# Altium schematic sheet Sheet1_Analog.SchDoc
size A4; Author: 卡文迪许怪; CompanyName: 创客工坊; DrawnBy: 创客工坊; Revision: Final; SheetNumber: 1; SheetTotal: 2
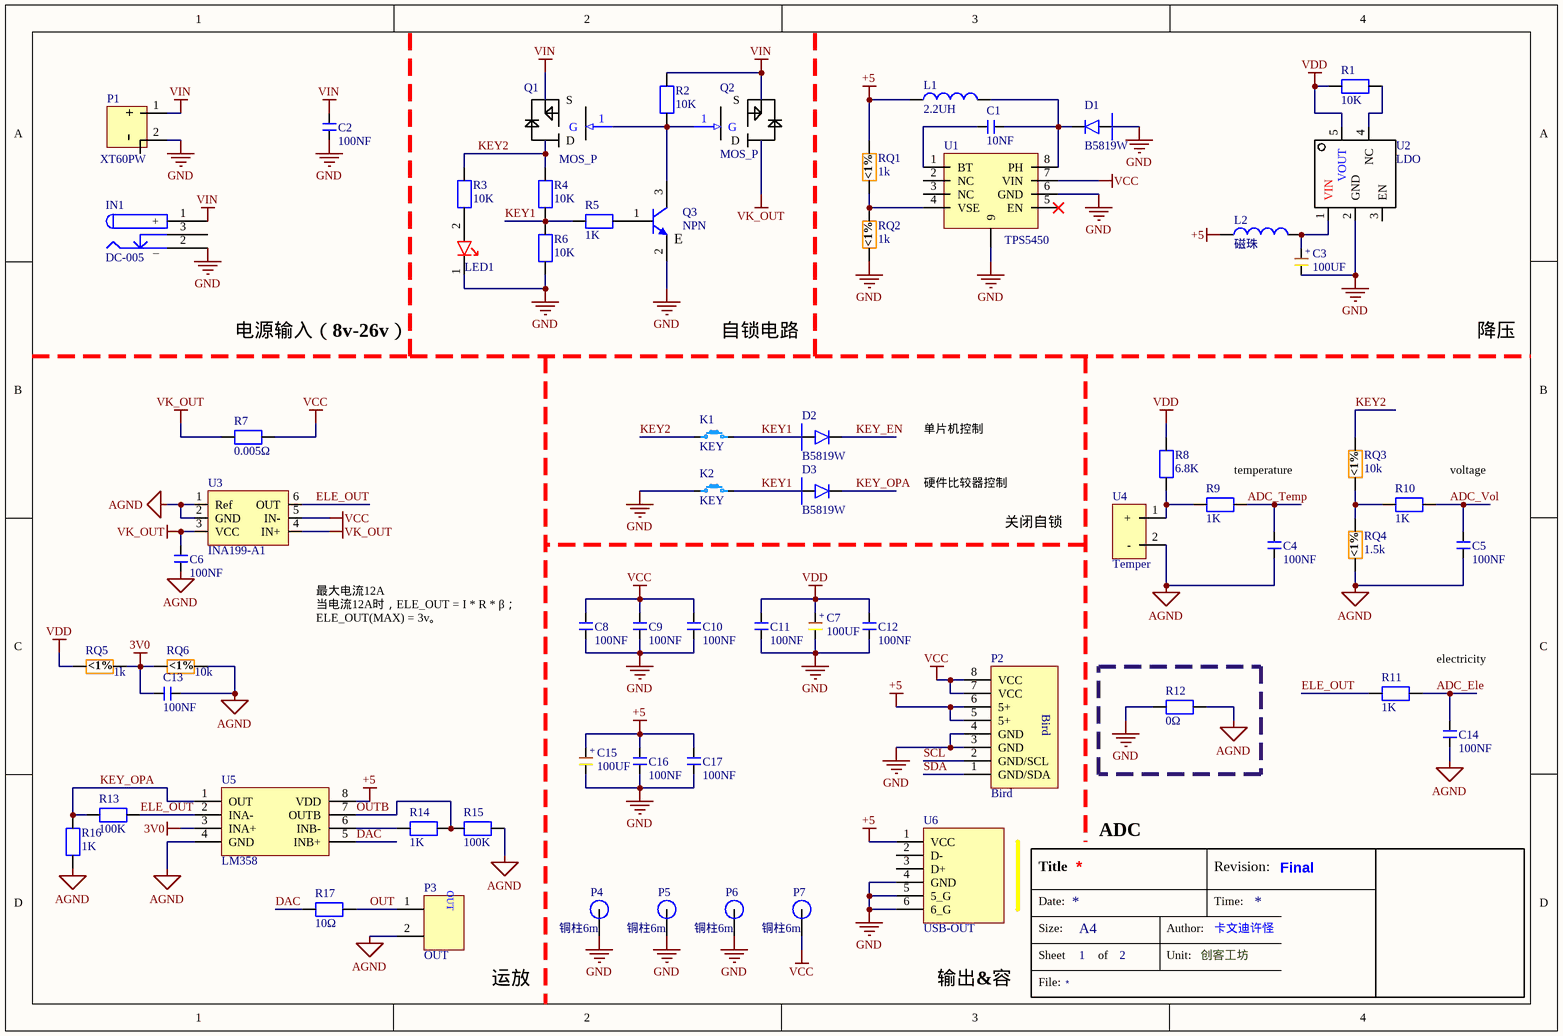
[diagram p0: Sheet1_Analog.SchDoc]

## Parts
C1  10NF  [CAP_0603]
C2  100NF  [CAP_0603]
C3  100UF  [CAP_6032_C]
C4  100NF  [CAP_0603]
C5  100NF  [CAP_0603]
C6  100NF  [CAP_0603]
C7  100UF  [CAP_6032_C]
C8  100NF  [CAP_0603]
C9  100NF  [CAP_1206]
C10  100NF  [CAP_0603]
C11  100NF  [CAP_0603]
C12  100NF  [CAP_0603]
C13  100NF  [CAP_0603]
C14  100NF  [CAP_0603]
C15  100UF  [CAP_6032_C]
C16  100NF  [CAP_0603]
C17  100NF  [CAP_0603]
D1  B5819W  [DIODE-SMB]
D2  B5819W  [DIODE_SOD123]
D3  B5819W  [DIODE_SOD123]
IN1  DC-005  [AC-DC-SMT]
K1  KEY  [KEY-C-Side-3]
K2  KEY  [KEY-C-Side-3]
L1  2.2UH  [INDUCTANCE_0630]
L2  磁珠  [Inductor_0603]
LED1  LED_R/G/B/Y  [LED_0603_R]  (value not drawn)
P1  XT60PW  [XT60-PW-M20]
P2  Bird  [XH2.54-WS-8P]
P3  OUT  [XH2.54-WS-2P]
P4  铜柱6m  [M3x6_L-Type]
P5  铜柱6m  [M3x6_L-Type]
P6  铜柱6m  [M3x6_L-Type]
P7  铜柱6m  [M3x6_L-Type]
Q1  MOS_P  [SOT23_3]
Q2  MOS_P  [TO252_2]
Q3  NPN  [SOT23_3]
R1  10K  [RESC_0603_2]
R2  10K  [RESC_0603_2]
R3  10K  [RESC_0603_2]
R4  10K  [RESC_0603_2]
R5  1K  [RESC_0603_2]
R6  10K  [RESC_0603_2]
R7  0.005Ω  [2512]
R8  6.8K  [RESC_0603_2]
R9  1K  [RESC_0603_2]
R10  1K  [RESC_0603_2]
R11  1K  [RESC_0603_2]
R12  0Ω  [RESC_0603_2]
R13  100K  [RESC_0603_2]
R14  1K  [RESC_0603_2]
R15  100K  [RESC_0603_2]
R16  1K  [RESC_0603_2]
R17  10Ω  [RESC_0603_2]
RQ1  1k  [RESC_0603_2]
RQ2  1k  [RESC_0603_2]
RQ3  10k  [RESC_0603_2]
RQ4  1.5k  [RESC_0603_2]
RQ5  1k  [RESC_0603_2]
RQ6  10k  [RESC_0603_2]
U1  TPS5450  [SOIC_8E]
U2  LDO  [SOT23_5]
U3  INA199-A1  [SOT-363]
U4  Temper  [RESC_0603_1]
U5  LM358  [MSOP_8]
U6  USB-OUT  [USB-A/F-S]

## Nets
3V0: C13.2 RQ5.2 RQ6.1 U5.3(INA+)
+5: C15.1 C16.2 C17.2 L1.1 L2.1 P2.5(5+) P2.6(5+) RQ1.2 U5.8(VDD) U6.1(VCC)
AGND: C4.1 C5.1 C6.1 C13.1 C14.1 P3.2 R12.2 R15.1 R16.1 RQ4.1 RQ6.2 U3.1(Ref) U3.2(GND) U4.2(-) U5.4(GND)
GND: C2.1 C3.2 C7.2 C8.1 C9.1 C10.1 C11.1 C12.1 C15.2 C16.1 C17.1 D1.1(P) IN1.2(_) K2.2 LED1.1(-) P1.2(-) P2.3(GND) P2.4(GND) P4.1(IO) P5.1(IO) P6.1(IO) Q3.2(E) R6.1 R12.1 RQ2.1 U1.6(GND) U1.9 U2.2(GND) U6.4(GND) U6.5(5_G) U6.6(6_G)
VCC: C8.2 C9.2 C10.2 P2.7(VCC) P2.8(VCC) P7.1(IO) R7.2 U1.7(VIN) U3.5(IN-)
VDD: C7.1 C11.2 C12.2 R1.2 R8.1 RQ5.1 U2.5(VOUT)
VIN: C2.2 IN1.1(+) P1.1(+) Q1.2(S) Q2.2(S) R2.2
VK_OUT: C6.2 Q2.3(D) R7.1 U3.3(VCC) U3.4(IN+)
ADC_Ele: C14.2 R11.2
ADC_Temp: C4.2 R9.2
ADC_Vol: C5.2 R10.2
DAC: R17.2 U5.5(INB+)
ELE_OUT: R11.1 R13.1 U3.6(OUT) U5.2(INA-)
KEY1: D2.1(P) D3.1(P) K1.1 K2.1 R4.1 R5.1 R6.2
KEY2: K1.2 Q1.3(D) R3.2 R4.2 RQ3.2
KEY_EN: D2.2(N)
KEY_OPA: D3.2(N) R13.2 R16.2 U5.1(OUT)
OUT: P3.1 R17.1
OUTB: R14.1 R15.2 U5.7(OUTB)
SCL: P2.2(GND/SCL)
SDA: P2.1(GND/SDA)
NetC1_1: C1.1 D1.2(N) L1.2 U1.8(PH)
NetC1_2: C1.2 U1.1(BT)
NetC3_1: C3.1 L2.2 U2.1(VIN)
NetLED1_2: LED1.2(+) R3.1
NetQ1_1: Q1.1(G) Q2.1(G) Q3.3(C) R2.1
NetQ3_1: Q3.1(B) R5.2
NetR1_1: R1.1 U2.4(NC)
NetR8_2: R8.2 R9.1 U4.1(+)
NetR10_1: R10.1 RQ3.1 RQ4.2
NetR14_2: R14.2 U5.6(INB-)
NetRQ1_1: RQ1.1 RQ2.2 U1.4(VSE)

Not connected (* = marked no-connect by the designer): IN1 3(_); P1 0(-); U1 2(NC) 3(NC) 5(EN)*; U2 3(EN); U6 2(D-) 3(D+)

## Notes on the sheet
- 电源输入（8v-26v）
- 自锁电路
- 降压
- 单片机控制
- 硬件比较器控制
- (near R9) temperature
- (near R10) voltage
- 关闭自锁
- 最大电流12A
  当电流12A时，ELE_OUT = I * R * β；
  ELE_OUT(MAX) = 3v。
- (near R11) electricity
- ADC
- 运放
- 输出&容
- Title
- Date:
- Revision:
- Time:
- File:
- Size:
- Sheet
- A4
- of
- Author:
- Unit:
- (in symbol CAP_TA) +
- (in symbol RES_quality) <1%

## Library data of the parts
C1 C2 C4-C6 C8-C14 C16 C17 = CAP: CAP  12~50V
C3 C7 C15 = CAP_TA: CAP  6~12V  钽电容
D1-D3 = Diode-SM: Diode_肖特基/二极管
IN1 = DC002: Interface
L1 L2 = Inductor: Code_IEC: 1005; Published: 8-Jun-2000; LatestRevisionDate: 29-May-2009; LatestRevisionNote: IPC-7351 Footprint Added.; PackageReference: 0402-A; Publisher: Altium Limited; PackageDescription: Chip Inductor; Code_JEITA: 0402
LED1 = LED_SMT: LED
P1 = XT60: Interface
P2 = Bird_8pin: Header
P3 = OUT_2PIN: Header
P4-P7 = Pillar: IN-OUT
Q1 Q2 = MOSFET_P: MOS
R1-R17 = RES: RES 贴片
RQ1-RQ6 = RES_quality: RES
U1 = TPS5450DDAR: DC-DC
U2 = LDO_SOT23-5: LDO  3.3V  500ma
U3 = INA199: INA199-A1_6PIN
U4 = Temper: Mode
U5 = LM(v)358: OPA,5v
U6 = USB-OUT: USB